# Altium project Badge_Galileo.PrjPcb
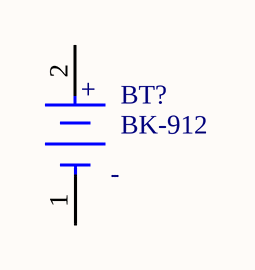
[diagram p0: badge.SchDoc]
1 sheet, 1 parts. Net scope: global (net labels, ports and power ports of the same name join across sheets).

## Sheet badge.SchDoc
size Letter; SheetNumber: 1; SheetTotal: 1

### Parts
BT?  BK-912  [FP-BK-912-MFG]

### Nets

Not connected (* = marked no-connect by the designer): BT? 1(C) 2(A)

### Notes on the sheet
- (in symbol CMP-136216-000003-1) +; -

### Library data of the parts
BT? = CMP-136216-000003-1: BATTERY RETAINER COIN 20MM SMD; Number of Cells: 1; Mount: Surface Mount; Termination: SMD/SMT; Package Quantity: 100; Case/Package: SMD/SMT